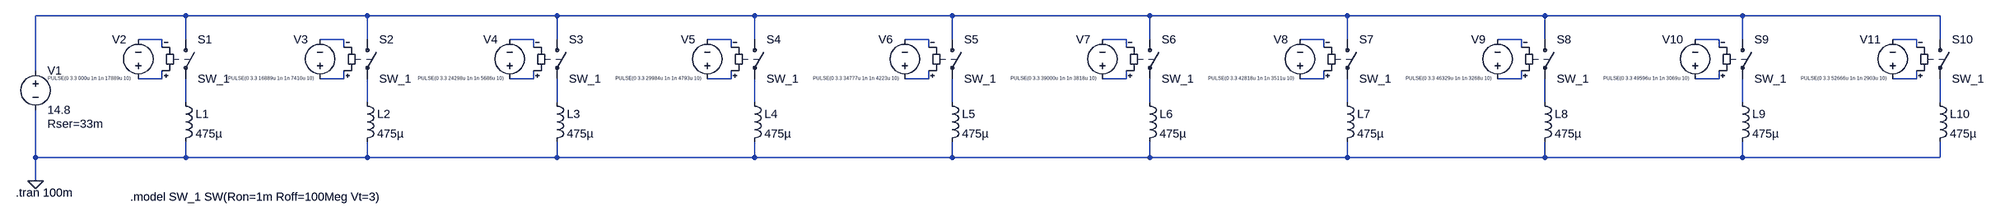
[diagram p0: schematic coilgun.asc]
coilgun.asc, the LTspice schematic file:
Version 4.1
SHEET 1 4080 680
WIRE 432 -16 128 -16
WIRE 800 -16 432 -16
WIRE 1184 -16 800 -16
WIRE 1584 -16 1184 -16
WIRE 1984 -16 1584 -16
WIRE 2384 -16 1984 -16
WIRE 2784 -16 2384 -16
WIRE 3184 -16 2784 -16
WIRE 3584 -16 3184 -16
WIRE 3984 -16 3584 -16
WIRE 384 32 336 32
WIRE 432 32 432 -16
WIRE 752 32 704 32
WIRE 800 32 800 -16
WIRE 1136 32 1088 32
WIRE 1184 32 1184 -16
WIRE 1536 32 1488 32
WIRE 1584 32 1584 -16
WIRE 1936 32 1888 32
WIRE 1984 32 1984 -16
WIRE 2336 32 2288 32
WIRE 2384 32 2384 -16
WIRE 2736 32 2688 32
WIRE 2784 32 2784 -16
WIRE 3136 32 3088 32
WIRE 3184 32 3184 -16
WIRE 3536 32 3488 32
WIRE 3584 32 3584 -16
WIRE 3936 32 3888 32
WIRE 3984 32 3984 -16
WIRE 384 48 384 32
WIRE 752 48 752 32
WIRE 1136 48 1136 32
WIRE 1536 48 1536 32
WIRE 1936 48 1936 32
WIRE 2336 48 2336 32
WIRE 2736 48 2736 32
WIRE 3136 48 3136 32
WIRE 3536 48 3536 32
WIRE 3936 48 3936 32
WIRE 128 96 128 -16
WIRE 384 112 384 96
WIRE 384 112 336 112
WIRE 752 112 752 96
WIRE 752 112 704 112
WIRE 1136 112 1136 96
WIRE 1136 112 1088 112
WIRE 1536 112 1536 96
WIRE 1536 112 1488 112
WIRE 1936 112 1936 96
WIRE 1936 112 1888 112
WIRE 2336 112 2336 96
WIRE 2336 112 2288 112
WIRE 2736 112 2736 96
WIRE 2736 112 2688 112
WIRE 3136 112 3136 96
WIRE 3136 112 3088 112
WIRE 3536 112 3536 96
WIRE 3536 112 3488 112
WIRE 3936 112 3936 96
WIRE 3936 112 3888 112
WIRE 432 160 432 112
WIRE 800 160 800 112
WIRE 1184 160 1184 112
WIRE 1584 160 1584 112
WIRE 1984 160 1984 112
WIRE 2384 160 2384 112
WIRE 2784 160 2784 112
WIRE 3184 160 3184 112
WIRE 3584 160 3584 112
WIRE 3984 160 3984 112
WIRE 128 272 128 176
WIRE 432 272 432 240
WIRE 432 272 128 272
WIRE 800 272 800 240
WIRE 800 272 432 272
WIRE 1184 272 1184 240
WIRE 1184 272 800 272
WIRE 1584 272 1584 240
WIRE 1584 272 1184 272
WIRE 1984 272 1984 240
WIRE 1984 272 1584 272
WIRE 2384 272 2384 240
WIRE 2384 272 1984 272
WIRE 2784 272 2784 240
WIRE 2784 272 2384 272
WIRE 3184 272 3184 240
WIRE 3184 272 2784 272
WIRE 3584 272 3584 240
WIRE 3584 272 3184 272
WIRE 3984 272 3984 240
WIRE 3984 272 3584 272
WIRE 128 320 128 272
FLAG 128 320 0
SYMBOL voltage 128 80 R0
WINDOW 123 0 0 Left 0
WINDOW 39 24 124 Left 2
SYMATTR SpiceLine Rser=33m
SYMATTR InstName V1
SYMATTR Value 14.8
SYMBOL ind 416 144 R0
SYMATTR InstName L1
SYMATTR Value 475µ
SYMBOL sw 432 16 R0
SYMATTR InstName S1
SYMATTR Value SW_1
SYMBOL voltage 336 128 R180
WINDOW 0 24 96 Left 2
WINDOW 3 100 10 Top 0
WINDOW 123 0 0 Left 0
WINDOW 39 0 0 Left 0
SYMATTR InstName V2
SYMATTR Value PULSE(0 3.3 000u 1n 1n 17889u 10)
SYMBOL ind 784 144 R0
SYMATTR InstName L2
SYMATTR Value 475µ
SYMBOL sw 800 16 R0
SYMATTR InstName S2
SYMATTR Value SW_1
SYMBOL voltage 704 128 R180
WINDOW 0 24 96 Left 2
WINDOW 3 100 10 Top 0
WINDOW 123 0 0 Left 0
WINDOW 39 0 0 Left 0
SYMATTR InstName V3
SYMATTR Value PULSE(0 3.3 16889u 1n 1n 7410u 10)
SYMBOL ind 1168 144 R0
SYMATTR InstName L3
SYMATTR Value 475µ
SYMBOL sw 1184 16 R0
SYMATTR InstName S3
SYMATTR Value SW_1
SYMBOL voltage 1088 128 R180
WINDOW 0 24 96 Left 2
WINDOW 3 100 10 Top 0
WINDOW 123 0 0 Left 0
WINDOW 39 0 0 Left 0
SYMATTR InstName V4
SYMATTR Value PULSE(0 3.3 24298u 1n 1n 5686u 10)
SYMBOL ind 1568 144 R0
SYMATTR InstName L4
SYMATTR Value 475µ
SYMBOL sw 1584 16 R0
SYMATTR InstName S4
SYMATTR Value SW_1
SYMBOL voltage 1488 128 R180
WINDOW 0 24 96 Left 2
WINDOW 3 100 10 Top 0
WINDOW 123 0 0 Left 0
WINDOW 39 0 0 Left 0
SYMATTR InstName V5
SYMATTR Value PULSE(0 3.3 29984u 1n 1n 4793u 10)
SYMBOL ind 1968 144 R0
SYMATTR InstName L5
SYMATTR Value 475µ
SYMBOL sw 1984 16 R0
SYMATTR InstName S5
SYMATTR Value SW_1
SYMBOL voltage 1888 128 R180
WINDOW 0 24 96 Left 2
WINDOW 3 100 10 Top 0
WINDOW 123 0 0 Left 0
WINDOW 39 0 0 Left 0
SYMATTR InstName V6
SYMATTR Value PULSE(0 3.3 34777u 1n 1n 4223u 10)
SYMBOL ind 2368 144 R0
SYMATTR InstName L6
SYMATTR Value 475µ
SYMBOL sw 2384 16 R0
SYMATTR InstName S6
SYMATTR Value SW_1
SYMBOL voltage 2288 128 R180
WINDOW 0 24 96 Left 2
WINDOW 3 100 10 Top 0
WINDOW 123 0 0 Left 0
WINDOW 39 0 0 Left 0
SYMATTR InstName V7
SYMATTR Value PULSE(0 3.3 39000u 1n 1n 3818u 10)
SYMBOL ind 2768 144 R0
SYMATTR InstName L7
SYMATTR Value 475µ
SYMBOL sw 2784 16 R0
SYMATTR InstName S7
SYMATTR Value SW_1
SYMBOL voltage 2688 128 R180
WINDOW 0 24 96 Left 2
WINDOW 3 100 10 Top 0
WINDOW 123 0 0 Left 0
WINDOW 39 0 0 Left 0
SYMATTR InstName V8
SYMATTR Value PULSE(0 3.3 42818u 1n 1n 3511u 10)
SYMBOL ind 3168 144 R0
SYMATTR InstName L8
SYMATTR Value 475µ
SYMBOL sw 3184 16 R0
SYMATTR InstName S8
SYMATTR Value SW_1
SYMBOL voltage 3088 128 R180
WINDOW 0 24 96 Left 2
WINDOW 3 100 10 Top 0
WINDOW 123 0 0 Left 0
WINDOW 39 0 0 Left 0
SYMATTR InstName V9
SYMATTR Value PULSE(0 3.3 46329u 1n 1n 3268u 10)
SYMBOL ind 3568 144 R0
SYMATTR InstName L9
SYMATTR Value 475µ
SYMBOL sw 3584 16 R0
SYMATTR InstName S9
SYMATTR Value SW_1
SYMBOL voltage 3488 128 R180
WINDOW 0 24 96 Left 2
WINDOW 3 100 10 Top 0
WINDOW 123 0 0 Left 0
WINDOW 39 0 0 Left 0
SYMATTR InstName V10
SYMATTR Value PULSE(0 3.3 49596u 1n 1n 3069u 10)
SYMBOL ind 3968 144 R0
SYMATTR InstName L10
SYMATTR Value 475µ
SYMBOL sw 3984 16 R0
SYMATTR InstName S10
SYMATTR Value SW_1
SYMBOL voltage 3888 128 R180
WINDOW 0 24 96 Left 2
WINDOW 3 100 10 Top 0
WINDOW 123 0 0 Left 0
WINDOW 39 0 0 Left 0
SYMATTR InstName V11
SYMATTR Value PULSE(0 3.3 52666u 1n 1n 2903u 10)
TEXT 88 344 Left 2 !.tran 100m
TEXT 320 352 Left 2 !.model SW_1 SW(Ron=1m Roff=100Meg Vt=3)

The netlist it stands for:
* coilgun.asc
V1 N001 0 14.8 Rser=33m
L1 N022 0 475µ
S1 N001 N022 N012 N002 SW_1
V2 N012 N002 PULSE(0 3.3 000u 1n 1n 17889u 10)
L2 N023 0 475µ
S2 N001 N023 N013 N003 SW_1
V3 N013 N003 PULSE(0 3.3 16889u 1n 1n 7410u 10)
L3 N024 0 475µ
S3 N001 N024 N014 N004 SW_1
V4 N014 N004 PULSE(0 3.3 24298u 1n 1n 5686u 10)
L4 N025 0 475µ
S4 N001 N025 N015 N005 SW_1
V5 N015 N005 PULSE(0 3.3 29984u 1n 1n 4793u 10)
L5 N026 0 475µ
S5 N001 N026 N016 N006 SW_1
V6 N016 N006 PULSE(0 3.3 34777u 1n 1n 4223u 10)
L6 N027 0 475µ
S6 N001 N027 N017 N007 SW_1
V7 N017 N007 PULSE(0 3.3 39000u 1n 1n 3818u 10)
L7 N028 0 475µ
S7 N001 N028 N018 N008 SW_1
V8 N018 N008 PULSE(0 3.3 42818u 1n 1n 3511u 10)
L8 N029 0 475µ
S8 N001 N029 N019 N009 SW_1
V9 N019 N009 PULSE(0 3.3 46329u 1n 1n 3268u 10)
L9 N030 0 475µ
S9 N001 N030 N020 N010 SW_1
V10 N020 N010 PULSE(0 3.3 49596u 1n 1n 3069u 10)
L10 N031 0 475µ
S10 N001 N031 N021 N011 SW_1
V11 N021 N011 PULSE(0 3.3 52666u 1n 1n 2903u 10)
.tran 100m
.model SW_1 SW(Ron=1m Roff=100Meg Vt=3)
.backanno
.end